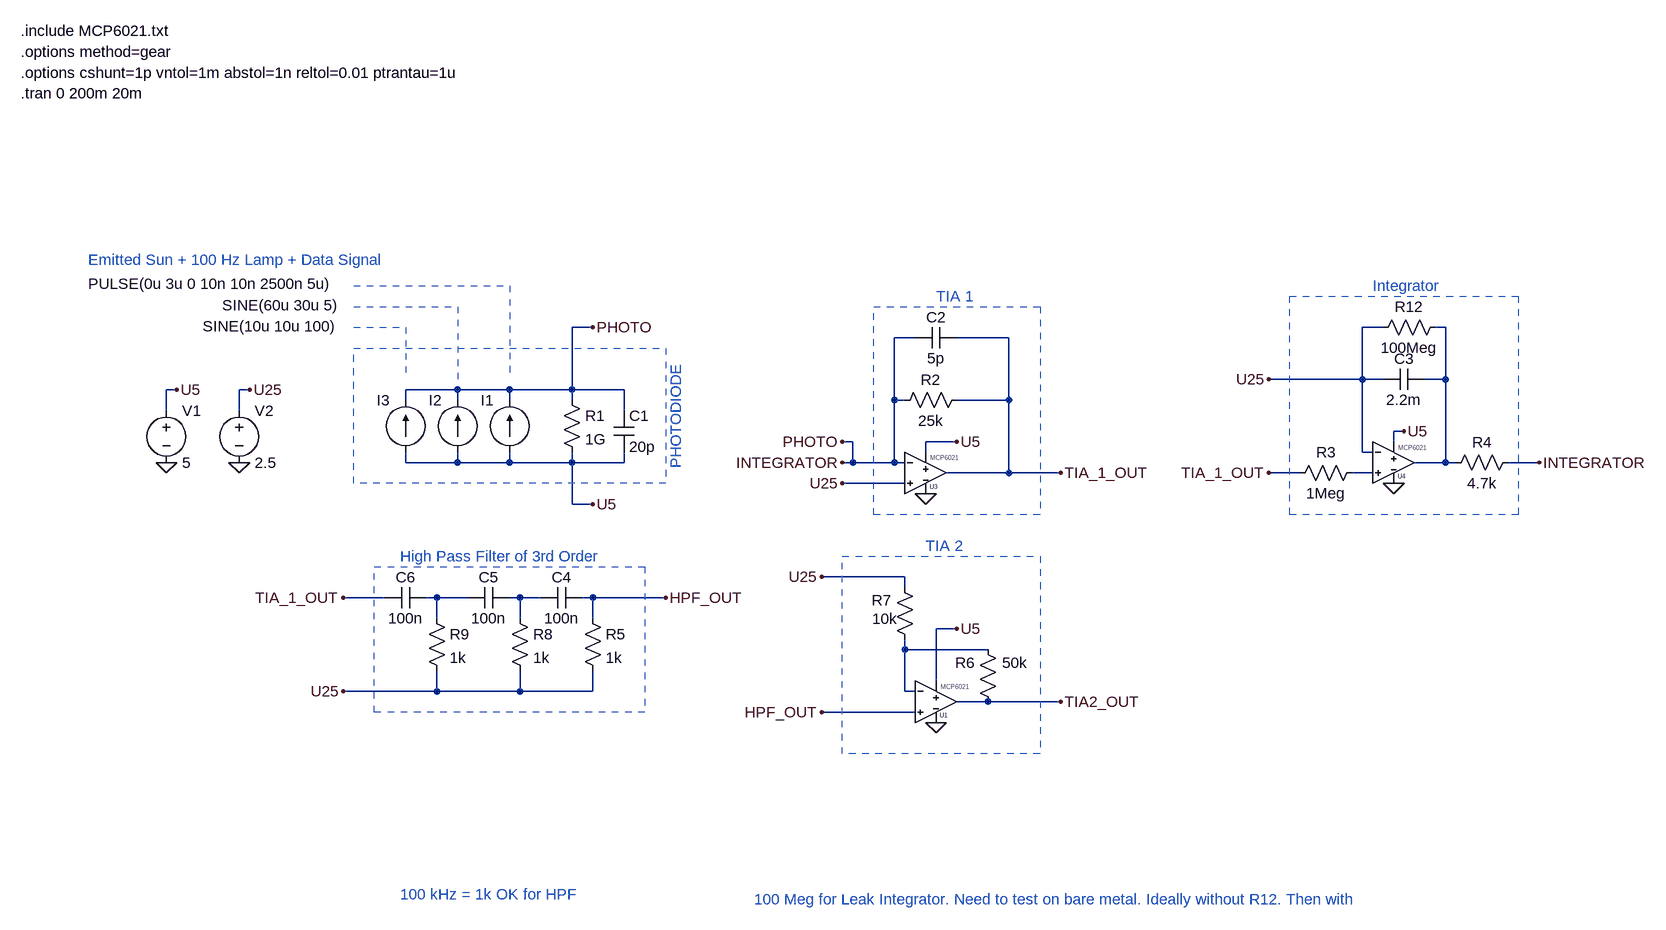
[diagram p0: schematic Odbiornik_WO_TLV3501.asc]
Odbiornik_WO_TLV3501.asc, the LTspice schematic file:
Version 4.1
SHEET 1 2432 1780
WIRE 240 384 208 384
WIRE 1456 384 1424 384
WIRE 1552 384 1536 384
WIRE 736 400 704 400
WIRE 880 400 800 400
WIRE 1424 464 1424 384
WIRE 1424 464 1280 464
WIRE 1456 464 1424 464
WIRE 1552 464 1552 384
WIRE 1552 464 1520 464
WIRE -400 480 -416 480
WIRE -288 480 -304 480
WIRE 32 480 -48 480
WIRE 112 480 32 480
WIRE 208 480 208 384
WIRE 208 480 112 480
WIRE 288 480 208 480
WIRE -48 496 -48 480
WIRE 32 496 32 480
WIRE 112 496 112 480
WIRE 208 496 208 480
WIRE 704 496 704 400
WIRE 720 496 704 496
WIRE 880 496 880 400
WIRE 880 496 800 496
WIRE -416 512 -416 480
WIRE -304 512 -304 480
WIRE 288 512 288 480
WIRE 1488 544 1472 544
WIRE 640 560 624 560
WIRE 800 560 752 560
WIRE 1472 560 1472 544
WIRE 752 576 752 560
WIRE 1424 576 1424 464
WIRE 1440 576 1424 576
WIRE -48 592 -48 576
WIRE 32 592 32 576
WIRE 32 592 -48 592
WIRE 112 592 112 576
WIRE 112 592 32 592
WIRE 208 592 208 576
WIRE 208 592 112 592
WIRE 288 592 288 576
WIRE 288 592 208 592
WIRE 640 592 640 560
WIRE 640 592 624 592
WIRE 704 592 704 496
WIRE 704 592 640 592
WIRE 720 592 704 592
WIRE 1552 592 1552 464
WIRE 1552 592 1504 592
WIRE 1568 592 1552 592
WIRE 1696 592 1648 592
WIRE 880 608 880 496
WIRE 880 608 784 608
WIRE 960 608 880 608
WIRE 1328 608 1280 608
WIRE 1440 608 1408 608
WIRE 720 624 624 624
WIRE 208 656 208 592
WIRE 240 656 208 656
WIRE 720 768 592 768
WIRE 720 784 720 768
WIRE -80 800 -144 800
WIRE 0 800 -16 800
WIRE 48 800 0 800
WIRE 128 800 112 800
WIRE 160 800 128 800
WIRE 240 800 224 800
WIRE 352 800 240 800
WIRE 0 832 0 800
WIRE 128 832 128 800
WIRE 240 832 240 800
WIRE 800 848 768 848
WIRE 720 880 720 864
WIRE 848 880 720 880
WIRE 768 928 768 848
WIRE 0 944 0 912
WIRE 0 944 -144 944
WIRE 128 944 128 912
WIRE 128 944 0 944
WIRE 240 944 240 912
WIRE 240 944 128 944
WIRE 720 944 720 880
WIRE 736 944 720 944
WIRE 848 960 800 960
WIRE 960 960 848 960
WIRE 736 976 592 976
FLAG -416 592 0
FLAG -304 592 0
FLAG 960 608 TIA_1_OUT
FLAG 960 960 TIA2_OUT
FLAG 240 384 PHOTO
FLAG 240 656 U5
FLAG 1488 544 U5
FLAG 752 640 0
FLAG 800 560 U5
FLAG 1280 464 U25
FLAG 624 624 U25
FLAG 624 592 INTEGRATOR
FLAG 1696 592 INTEGRATOR
FLAG 1472 624 0
FLAG 1280 608 TIA_1_OUT
FLAG -144 944 U25
FLAG -144 800 TIA_1_OUT
FLAG 352 800 HPF_OUT
FLAG 592 976 HPF_OUT
FLAG 592 768 U25
FLAG 800 848 U5
FLAG 768 992 0
FLAG -400 480 U5
FLAG -288 480 U25
FLAG 624 560 PHOTO
SYMBOL res 192 480 R0
SYMATTR InstName R1
SYMATTR Value 1G
SYMBOL cap 272 512 R0
SYMATTR InstName C1
SYMATTR Value 20p
SYMBOL current 112 576 R180
WINDOW 0 24 80 Left 2
WINDOW 3 648 259 Right 2
WINDOW 123 0 0 Left 0
WINDOW 39 0 0 Left 0
SYMATTR InstName I1
SYMATTR Value PULSE(0u 3u 0 10n 10n 2500n 5u)
SYMBOL voltage -416 496 R0
WINDOW 123 0 0 Left 0
WINDOW 39 0 0 Left 0
SYMATTR InstName V1
SYMATTR Value 5
SYMBOL voltage -304 496 R0
WINDOW 123 0 0 Left 0
WINDOW 39 0 0 Left 0
SYMATTR InstName V2
SYMATTR Value 2.5
SYMBOL res 816 480 R90
WINDOW 0 0 56 VBottom 2
WINDOW 3 32 56 VTop 2
SYMATTR InstName R2
SYMATTR Value 25k
SYMBOL cap 800 384 R90
WINDOW 0 0 32 VBottom 2
WINDOW 3 32 32 VTop 2
SYMATTR InstName C2
SYMATTR Value 5p
SYMBOL res 1312 624 R270
WINDOW 0 32 56 VTop 2
WINDOW 3 0 56 VBottom 2
SYMATTR InstName R3
SYMATTR Value 1Meg
SYMBOL cap 1456 480 R270
WINDOW 0 32 32 VTop 2
WINDOW 3 0 32 VBottom 2
SYMATTR InstName C3
SYMATTR Value 2.2m
SYMBOL res 1552 608 R270
WINDOW 0 32 56 VTop 2
WINDOW 3 0 56 VBottom 2
SYMATTR InstName R4
SYMATTR Value 4.7k
SYMBOL current 32 576 R180
WINDOW 0 24 80 Left 2
WINDOW 3 362 226 Right 2
WINDOW 123 0 0 Left 0
WINDOW 39 0 0 Left 0
SYMATTR InstName I2
SYMATTR Value SINE(60u 30u 5)
SYMBOL cap 224 784 R90
WINDOW 0 0 32 VBottom 2
WINDOW 3 32 32 VTop 2
SYMATTR InstName C4
SYMATTR Value 100n
SYMBOL res 224 816 R0
SYMATTR InstName R5
SYMATTR Value 1k
SYMBOL res 864 976 R180
WINDOW 0 36 76 Left 2
WINDOW 3 -45 76 Left 2
SYMATTR InstName R6
SYMATTR Value 50k
SYMBOL res 736 880 R180
WINDOW 0 36 76 Left 2
WINDOW 3 27 48 Left 2
SYMATTR InstName R7
SYMATTR Value 10k
SYMBOL MCP6021 768 960 R0
SYMATTR InstName U1
SYMBOL MCP6021 752 608 R0
SYMATTR InstName U3
SYMBOL MCP6021 1472 592 R0
SYMATTR InstName U4
SYMBOL cap 112 784 R90
WINDOW 0 0 32 VBottom 2
WINDOW 3 32 32 VTop 2
SYMATTR InstName C5
SYMATTR Value 100n
SYMBOL res 112 816 R0
SYMATTR InstName R8
SYMATTR Value 1k
SYMBOL current -48 576 R180
WINDOW 0 24 80 Left 2
WINDOW 3 312 194 Right 2
WINDOW 123 0 0 Left 0
WINDOW 39 0 0 Left 0
SYMATTR InstName I3
SYMATTR Value SINE(10u 10u 100)
SYMBOL cap -16 784 R90
WINDOW 0 0 32 VBottom 2
WINDOW 3 32 32 VTop 2
SYMATTR InstName C6
SYMATTR Value 100n
SYMBOL res -16 816 R0
SYMATTR InstName R9
SYMATTR Value 1k
SYMBOL res 1440 400 R270
WINDOW 0 32 56 VTop 2
WINDOW 3 0 56 VBottom 2
SYMATTR InstName R12
SYMATTR Value 100Meg
TEXT -640 24 Left 2 !.tran 0 200m 20m
TEXT -640 -72 Left 2 !.include MCP6021.txt
TEXT -640 -40 Left 2 !.options method=gear
TEXT -640 -8 Left 2 !.options cshunt=1p vntol=1m abstol=1n reltol=0.01 ptrantau=1u
TEXT -56 1256 Left 2 ;100 kHz = 1k OK for HPF
TEXT 368 440 VRight 2 ;PHOTODIODE
TEXT -536 280 Left 2 ;Emitted Sun + 100 Hz Lamp + Data Signal
TEXT 768 336 Left 2 ;TIA 1
TEXT 1440 320 Left 2 ;Integrator
TEXT -56 736 Left 2 ;High Pass Filter of 3rd Order
TEXT 752 720 Left 2 ;TIA 2
TEXT 488 1264 Left 2 ;100 Meg for Leak Integrator. Need to test on bare metal. Ideally without R12. Then with
LINE Normal 112 320 112 464 2
LINE Normal -128 320 112 320 2
LINE Normal 32 352 32 464 2
LINE Normal -128 352 32 352 2
LINE Normal -48 384 -48 464 2
LINE Normal -128 384 -48 384 2
RECTANGLE Normal -128 416 352 624 1
RECTANGLE Normal 928 672 672 352 1
RECTANGLE Normal 1312 336 1664 672 1
RECTANGLE Normal 320 976 -96 752 1
RECTANGLE Normal 928 1040 624 736 1

The netlist it stands for:
* Odbiornik_WO_TLV3501.asc
R1 INTEGRATOR U5 1G
C1 INTEGRATOR U5 20p
I1 U5 INTEGRATOR PULSE(0u 3u 0 10n 10n 2500n 5u)
V1 U5 0 5
V2 U25 0 2.5
R2 TIA_1_OUT INTEGRATOR 25k
C2 TIA_1_OUT INTEGRATOR 5p
R3 TIA_1_OUT N002 1Meg
C3 U25 N001 2.2m
R4 N001 INTEGRATOR 4.7k
I2 U5 INTEGRATOR SINE(60u 30u 5)
C4 HPF_OUT N004 100n
R5 HPF_OUT U25 1k
R6 TIA2_OUT N005 50k
R7 N005 U25 10k
X§U1 HPF_OUT N005 U5 0 TIA2_OUT MCP6021  ; pins In+ In- V+ V- OUT
X§U3 U25 INTEGRATOR U5 0 TIA_1_OUT MCP6021  ; pins In+ In- V+ V- OUT
X§U4 N002 U25 U5 0 N001 MCP6021  ; pins In+ In- V+ V- OUT
C5 N004 N003 100n
R8 N004 U25 1k
I3 U5 INTEGRATOR SINE(10u 10u 100)
C6 N003 TIA_1_OUT 100n
R9 N003 U25 1k
R12 U25 N001 100Meg
.tran 0 200m 20m
.include MCP6021.txt
.options method=gear
.options cshunt=1p vntol=1m abstol=1n reltol=0.01 ptrantau=1u
* 100 kHz = 1k OK for HPF
* PHOTODIODE
* Emitted Sun + 100 Hz Lamp + Data Signal
* TIA 1
* Integrator
* High Pass Filter of 3rd Order
* TIA 2
* 100 Meg for Leak Integrator. Need to test on bare metal. Ideally without R12. Then with
.backanno
.end